# EAGLE design power_extension_revision (EAGLE 8.0.1)
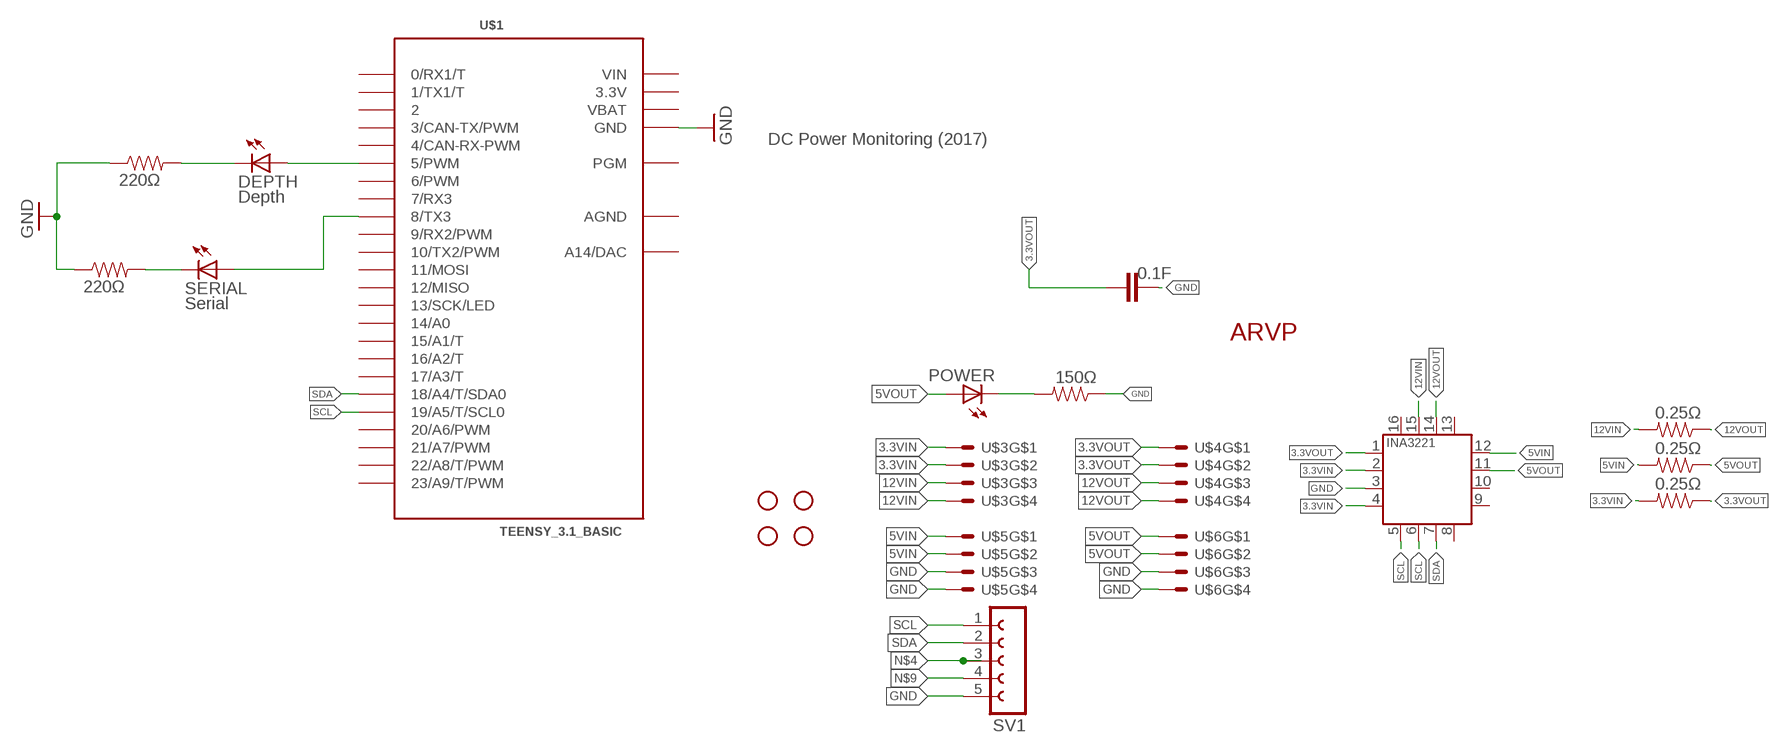
[diagram p0: schematic, sheet 1]

## Parts
C1  0.1F  CAP0805  [0805]
DEPTH  Depth  LEDCHIP-LED0805  [CHIP-LED0805]
JP1  STAND-OFF  [STAND-OFF]
JP2  STAND-OFF  [STAND-OFF]
JP3  STAND-OFF  [STAND-OFF]
JP4  STAND-OFF  [STAND-OFF]
POWER  LEDCHIP-LED0805  [CHIP-LED0805]
R1  150Ω  RESISTOR0805-RES  [0805]
R4  0.25Ω  RESISTOR0805-RES  [0805]
R5  0.25Ω  RESISTOR0805-RES  [0805]
R7  220Ω  RESISTOR0805-RES  [0805]
R8  220Ω  RESISTOR0805-RES  [0805]
R18  0.25Ω  RESISTOR0805-RES  [0805]
SERIAL  Serial  LEDCHIP-LED0805  [CHIP-LED0805]
SV1  FE05-1  [FE05-1]
U1  INA3221.  [HVQFN16_4X4]
U$1  TEENSY_3.1_BASIC  [TEENSY_3.1_BASIC]
U$2  ARVP_LOGO  [ARVP]
U$3  MOLEX-44472-0454  [4.2MM_PITCH_HOLESX4]
U$4  MOLEX-44472-0454  [4.2MM_PITCH_HOLESX4]
U$5  MOLEX-44472-0454  [4.2MM_PITCH_HOLESX4]
U$6  MOLEX-44472-0454  [4.2MM_PITCH_HOLESX4]

## Nets
3.3VIN: R5.2 U1.2(IN+3) U1.4(VS) U$3.P$1 U$3.P$2
3.3VOUT: C1.1 R5.1 U1.1(IN-3) U$4.P$1 U$4.P$2
5VIN: R4.2 U1.12(IN+1) U$5.P$1 U$5.P$2
5VOUT: POWER.A R4.1 U1.11(IN-1) U$6.P$1 U$6.P$2
12VIN: R18.2 U1.15(IN+2) U$3.P$3 U$3.P$4
12VOUT: R18.1 U1.14(IN-2) U$4.P$3 U$4.P$4
GND: C1.2 R1.1 R7.1 R8.1 SV1.5 U1.3(GND) U$1.GND U$1.GND1(GND) U$5.P$3 U$5.P$4 U$6.P$3 U$6.P$4
N$3: POWER.C R1.2
N$4: DEPTH.A SV1.3 U$1.5(5/PWM)
N$8: R7.2 SERIAL.C
N$9: SERIAL.A SV1.4 U$1.8(8/TX3)
N$12: DEPTH.C R8.2
SCL: SV1.1 U1.5(A0) U1.6(SCL) U$1.19/A5(19/A5/T/SCL0)
SDA: SV1.2 U1.7(SDA) U$1.18/A4(18/A4/T/SDA0)
Unconnected: U1.8(WARNING) U1.9(CRITICAL) U1.10(PV) U1.13(TC) U1.16(VPU) U$1.0(0/RX1/T) U$1.1(1/TX1/T) U$1.2 U$1.3(3/CAN-TX/PWM) U$1.4(4/CAN-RX-PWM) U$1.6(6/PWM) U$1.7(7/RX3) U$1.9(9/RX2/PWM) U$1.10(10/TX2/PWM) U$1.11(11/MOSI) U$1.12(12/MISO) U$1.13(13/SCK/LED) U$1.14/A0 U$1.15/A1(15/A1/T) U$1.16/A2(16/A2/T) U$1.17/A3(17/A3/T) U$1.20/A6(20/A6/PWM) U$1.21/A7(21/A7/PWM) U$1.22/A8(22/A8/T/PWM) U$1.23/A9(23/A9/T/PWM) U$1.A14(A14/DAC) U$1.PGM

## Notes on the sheet
- DC Power Monitoring (2017)

## Power pins joined to a net without a drawn wire
3.3V: U$1.3.3V U$1.3.3V1(3.3V)
AGND: U$1.AGND
VBAT: U$1.VBAT
VIN: U$1.VIN

## Library data of the parts
C1 = SparkFun-Capacitors:CAP: Capacitor Standard 0603 ceramic capacitor, and 0.1" leaded capacitor.
DEPTH POWER SERIAL = adafruit:LED: LED OSRAM: - CHIPLED LG R971, LG N971, LY N971, LG Q971, LY Q971, LO R971, LY R971 LH N974, LH R974 LS Q976, LO Q976, LY Q976 LO Q996 - Hyper CHIPLED LW Q18S LB Q993, LB Q99A, LB R99A - SideLED LS A670, LO A670, LY A670, LG A670, LP A670 LB A673, LV A673, LT A673, LW A673 LH A674 LY A675 LS A676, LA A676, LO A676, LY A676, LW A676 LS A679, LY A679, LG A679 - Hyper Micro SIDELED® LS Y876, LA Y876, LO Y876, LY Y876 LT Y87S - SmartLED LW L88C, LW L88S LB L89C, LB L89S, LG L890 LS L89K, LO L89K, LY L89K LS L896, LA L896, LO L896, LY L896 - TOPLED LS T670, LO T670, LY T670, LG T670, LP T670 LSG T670, LSP T670, LSY T670, LOP T670, LYG T670 LG T671, LOG T671, LSG T671 LB T673, LV T673, LT T673, LW T673 LH T674 LS T676, LA T676, LO T676, LY T676, LB T676, LH T676, LSB T676, LW T676 LB T67C, LV T67C, LT T67C, LS T67K, LO T67K, LY T67K, LW E67C LS E67B, LA E67B, LO E67B, LY E67B, LB E67C, LV E67C, LT E67C LW T67C LS T679, LY T679, LG T679 LS T770, LO T770, LY T770, LG T770, LP T770 LB T773, LV T773, LT T773, LW T773 LH T774 LS E675, LA E675, LY E675, LS T675 LS T776, LA T776, LO T776, LY T776, LB T776 LHGB T686 LT T68C, LB T68C - Hyper Mini TOPLED® LB M676 - Mini TOPLED Santana® LG M470 LS M47K, LO M47K, LY M47K Source: http://www.osram.convergy.de/
JP1-JP4 = SparkFun:STAND-OFF: Stand Off This is the mechanical footprint for a #4 phillips button head screw. Use the keepout ring to avoid running the screw head into surrounding components. SKU : PRT-00447
R1 R4 R5 R7 R8 R18 = SparkFun:RESISTOR: Resistor Basic schematic elements and footprints for 0603, 1206, and PTH resistors.
SV1 = con-lsta:FE05-1: FEMALE HEADER; OC_FARNELL: unknown; OC_NEWARK: unknown
U1 = INA3221:INA3221: The INA3221 is a three-channel, high-side current and bus voltage monitor with an I 2C- and SMBUScompatible interface. The INA3221 monitors both shunt voltage drops and bus supply voltages, in addition to having programmable conversion times and averaging modes for these signals. The INA3221 offers both critical and warning alerts to detect multiple programmable out-of-range conditions for each channel.
U$1 = Teensy_3_Series_Board_v1.0:TEENSY_3.1_BASIC: Footprint for Teensy 3.1 board using all pin connections on the outer perimeter
U$2 = ARVP:ARVP_LOGO
U$3-U$6 = motor:MOLEX-44472-0454

## Net classes
0 default: width 0.178 mm, drill 0.254 mm, clearance 0.178 mm

## Board
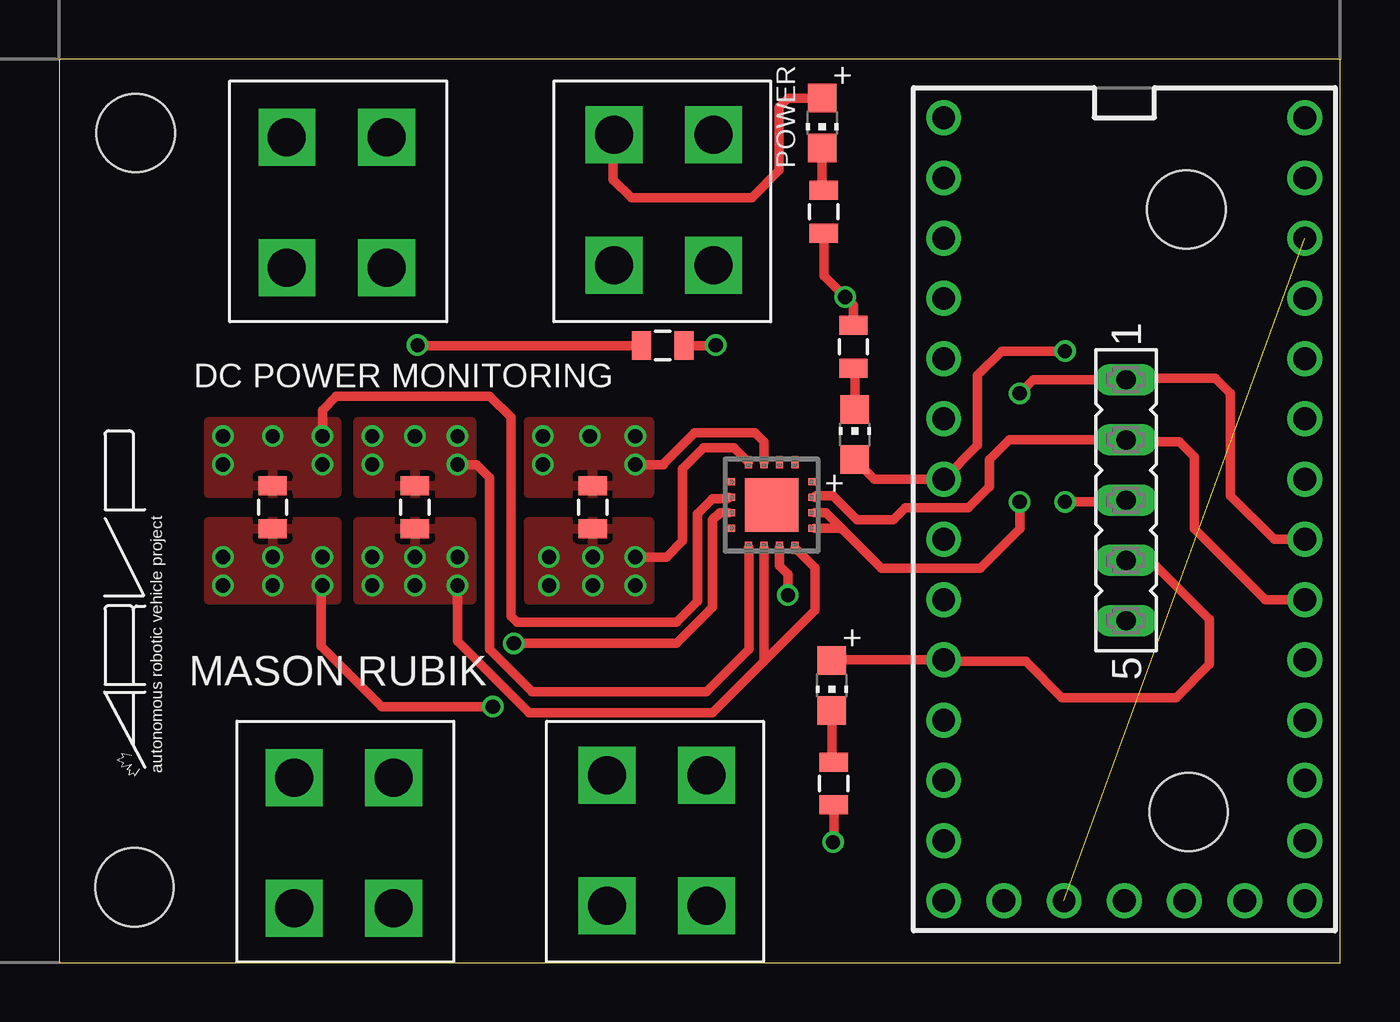
[diagram p1: board, top side]
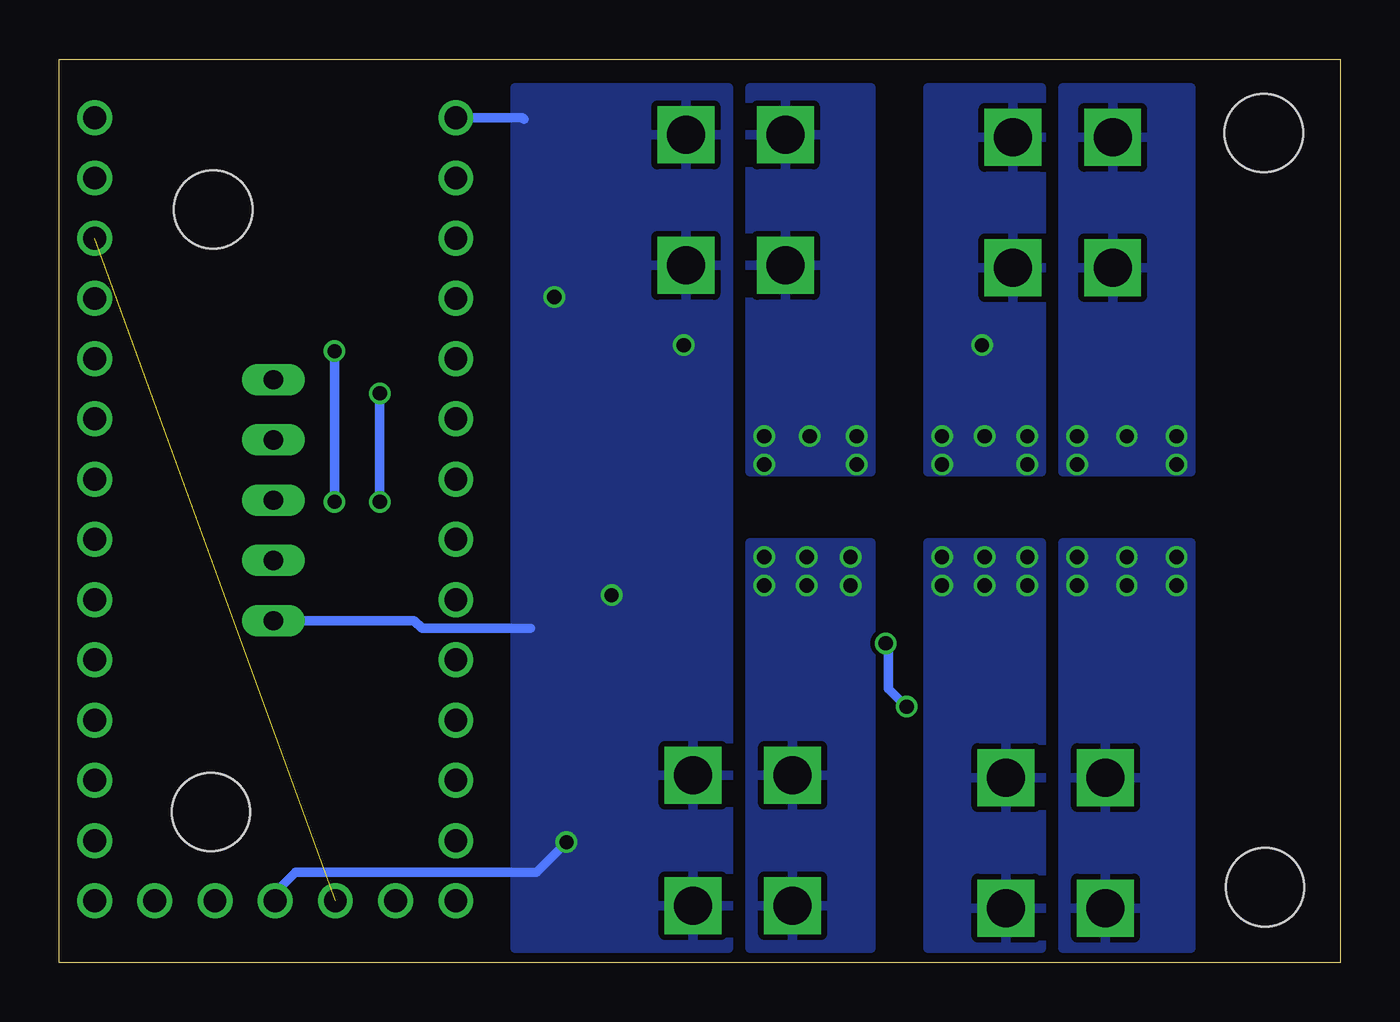
[diagram p2: board, bottom side, seen from below]

Size 54.03 x 38.09 mm. Coordinates in mm from the lower left corner, seen from the top.
Outline: 0,0 54.03,0 54.03,38.09 0,38.09 0,0
Copper layers (1*16): Top 0.035mm / dielectric 1.5mm / Bottom 0.035mm
Design rules "ITEADstudioDRC *": minimum track width 6mil, minimum drill 12mil, track to track 7mil, track to pad 7mil, pad to pad 7mil, via to via 7mil, smd to smd 0mil, copper to edge 10mil, drill to drill 10mil, minimum pad ring 10mil, minimum via ring 6mil, stop-mask expansion 2mil, vias tented up to drill 100mil, thermal gap 10mil

### Footprints (pad centres in the part's own frame; a part is rotated, then mirrored left to right if it is on the bottom)
0805 = smd 0.8 x 1.2: 1 -0.9,0; 2 0.9,0
CHIP-LED0805 = smd 1.2 x 1.2: A 0,-1.05; C 0,1.05
STAND-OFF = hole 3.302: 0,0
FE05-1 = drill 0.813 long: 1 -5.08,0; 2 -2.54,0; 3 0,0; 4 2.54,0; 5 5.08,0
HVQFN16_4X4 = smd 0.5 x 0.3: 1 -1.8,0.975; 2 -1.8,0.325; 3 -1.8,-0.325; 4 -1.8,-0.975; 9 1.8,-0.975; 10 1.8,-0.325; 11 1.8,0.325; 12 1.8,0.975 | smd 0.3 x 0.5: 5 -0.975,-1.8; 6 -0.325,-1.8; 7 0.325,-1.8; 8 0.975,-1.8; 13 0.975,1.8; 14 0.325,1.8; 15 -0.325,1.8; 16 -0.975,1.8 | smd 2.25 x 2.25: TH 0,0
TEENSY_3.1_BASIC = drill 0.965: 0 -7.62,13.97; 1 -7.62,11.43; 2 -7.62,8.89; 3 -7.62,6.35; 3.3V 7.62,11.43; 3.3V1 -2.54,-16.51; 4 -7.62,3.81; 5 -7.62,1.27; 6 -7.62,-1.27; 7 -7.62,-3.81; 8 -7.62,-6.35; 9 -7.62,-8.89; 10 -7.62,-11.43; 11 -7.62,-13.97; 12 -7.62,-16.51; 13 7.62,-16.51; 14/A0 7.62,-13.97; 15/A1 7.62,-11.43; 16/A2 7.62,-8.89; 17/A3 7.62,-6.35; 18/A4 7.62,-3.81; 19/A5 7.62,-1.27; 20/A6 7.62,1.27; 21/A7 7.62,3.81; 22/A8 7.62,6.35; 23/A9 7.62,8.89; A14 5.08,-16.51; AGND 7.62,13.97; GND -7.62,16.51; GND1 0,-16.51; PGM 2.54,-16.51; VBAT -5.08,-16.51; VIN 7.62,16.51
4.2MM_PITCH_HOLESX4 = drill 1.6 square: P$1 0,2.8; P$2 0,-2.7; P$3 4.2,2.8; P$4 4.2,-2.7

### Placement (x,y rotation side)
C1  25.45,26.01 0 top
DEPTH  33.56,22.27 0 top
JP1  3.22,34.98 0 top
JP2  47.54,31.75 0 top
JP3  3.17,3.17 0 top
JP4  47.63,6.35 0 top
POWER  32.18,35.4 180 top
R1  32.24,31.66 90 top
R4  22.5,19.2 270 top
R5  15,19.2 270 top
R7  32.67,7.55 90 top
R8  33.5,25.97 270 top
R18  9,19.2 270 top
SERIAL  32.59,11.68 180 top
SV1  45,19.5 270 top
U1  30.05,19.3 90 top
U$1  44.92,19.11 0 top
U$2  4.34,8 90 top
U$3  14.1,5.1 180 top
U$4  13.8,32.1 180 top
U$5  23.1,5.1 0 top
U$6  23.4,32.1 0 top

### Tracks (layer width: path | path; a pad name or v marks a point on that pad's centre or on a via)
3.3V  (1 unrouted)
3.3VIN  (via drill 0.6)
  Top 0.406: v16.8,15.9 16.8,13.55 19.81,10.54 27.56,10.54 29.72,12.7 | 29.72,12.7 29.72,17.49 U1.2 | U1.4 31.88,16.64 31.88,14.86 29.72,12.7
  other vias: 16.8,17.1 15,17.1 15,15.9 13.2,17.1 13.2,15.9
  pour Top: 12.6,15.3 17.4,15.3 17.4,18.6 12.6,18.6
  pour Bottom: 12.6,0.6 17.4,0.6 17.4,17.7 12.6,17.7
3.3VOUT  (via drill 0.6)
  Top 0.406: v16.8,21 17.61,21 18.16,20.45 18.16,13.21 19.94,11.43 27.3,11.43 29.08,13.21 29.08,17.49 U1.1 | C1.1 15.13,26.01 v15.11,26.04
  other vias: 13.2,21 13.2,22.2 15,22.2 16.8,22.2
  pour Bottom: 12.6,20.7 17.4,20.7 17.4,36.9 12.6,36.9
  pour Top: 12.6,19.8 17.4,19.8 17.4,22.8 12.6,22.8
5VIN  (via drill 0.6)
  Top 0.406: U1.12 28.45,21.72 27.18,21.72 26.29,20.83 26.29,17.78 25.61,17.1 v24.3,17.1
  other vias: 20.65,17.1 22.5,17.1 20.65,15.9 22.5,15.9 24.3,15.9
  pour Top: 19.8,15.3 24.9,15.3 24.9,18.6 19.8,18.6
  pour Bottom: 24.9,0.6 19.8,0.6 19.8,17.7 24.9,17.7
5VOUT  (via drill 0.6)
  Top 0.406: 24.72,21 v24.3,21 25.48,21 25.48,21.04 26.8,22.35 29.34,22.35 29.72,21.97 29.72,21.1 U1.11 | POWER.A 30.73,36.45 30.35,36.07 30.35,33.4 29.21,32.26 24.13,32.26 23.37,33.02 23.37,34.87 U$6.P$1
  other vias: 20.4,22.2 20.4,21 22.37,22.2 24.3,22.2
  pour Bottom: 19.8,20.7 24.9,20.7 24.9,36.9 19.8,36.9
  pour Top: 19.8,19.8 24.9,19.8 24.9,22.8 19.8,22.8
12VIN  (via drill 0.6)
  Top 0.406: v18.29,10.79 13.59,10.79 11.05,13.34 11.05,15.85 v11.1,15.9 | v19.18,13.46 26.04,13.46 27.56,14.99 27.56,18.67 27.86,18.97 U1.15
  Bottom 0.406: v18.29,10.79 19.05,11.56 19.05,13.34 v19.18,13.46
  other vias: 11.1,17.1 9,15.9 9,17.1 6.9,17.1 6.9,15.9
  pour Bottom: 11.7,0.6 11.7,17.7 6.3,17.7 6.3,0.6
  pour Top: 6.3,18.6 11.7,18.6 11.7,15.3 6.3,15.3
12VOUT  (via drill 0.6)
  Top 0.406: v11.1,22.2 11.1,23.29 11.68,23.88 18.16,23.88 19.05,22.99 19.05,14.61 19.3,14.35 26.04,14.35 26.92,15.24 26.92,18.92 27.56,19.56 28.19,19.56 U1.14
  other vias: 6.9,21 6.9,22.2 9,22.2 11.1,21
  pour Bottom: 11.7,20.7 6.3,20.7 6.3,36.9 11.7,36.9
  pour Top: 6.3,19.8 11.7,19.8 11.7,22.8 6.3,22.8
GND  (via drill 0.6)
  Top 0.406: C1.2 27.66,26.01 v27.69,26.04 | R1.1 32.24,28.97 v33.15,28.07 33.5,27.71 R8.1 | U1.3 30.38,16.74 30.73,16.38 v30.73,15.49 | R7.1 32.67,5.11 v32.64,5.08
  Bottom 0.406: U$1.GND 34.48,35.62 34.42,35.56 | SV1.5 39.06,14.42 38.73,14.1 34.16,14.1 | U$1.GND1 44.92,2.95 44.07,3.81 33.91,3.81 v32.64,5.08
  pour Bottom: 25.8,0.6 34.8,0.6 34.8,36.9 25.8,36.9
N$3
  Top 0.406: POWER.C 32.18,32.62 R1.2
N$4  (via drill 0.6)
  Top 0.406: SV1.3 44.93,19.43 v42.42,19.43 | v42.42,25.78 39.75,25.78 38.73,24.77 38.73,21.82 U$1.5 34.39,20.39 DEPTH.A
  Bottom 0.406: v42.42,19.43 v42.42,25.78
N$8
  Top 0.406: SERIAL.C 32.59,8.53 R7.2
N$9
  Top 0.406: SV1.4 46.03,16.96 48.51,14.48 48.51,12.57 47.12,11.18 42.29,11.18 40.77,12.7 37.37,12.7 U$1.8 32.62,12.77 SERIAL.A
N$12
  Top 0.406: DEPTH.C 33.56,25.01 R8.2
SCL  (via drill 0.6)
  Top 0.406: U$1.19/A5 51.24,17.84 49.4,19.68 49.4,24 48.77,24.64 45.06,24.64 SV1.1 41.09,24.58 v40.51,24 | v40.51,19.43 40.51,18.29 38.86,16.64 34.67,16.64 33.08,18.22 | U1.6 32.34,18.97 33.08,18.22 | U1.5 32.99,18.32 33.08,18.22
  Bottom 0.406: v40.51,24 v40.51,19.43
SDA
  Top 0.406: U1.7 31.91,19.68 32.64,19.68 33.66,18.67 35.18,18.67 35.69,19.18 38.35,19.18 39.24,20.07 39.24,21.21 40.07,22.04 SV1.2 45.07,21.97 47.24,21.97 47.88,21.34 47.88,18.29 50.86,15.3 U$1.18/A4

### Text on the board
tPlace: DC POWER MONITORING | MASON RUBIK